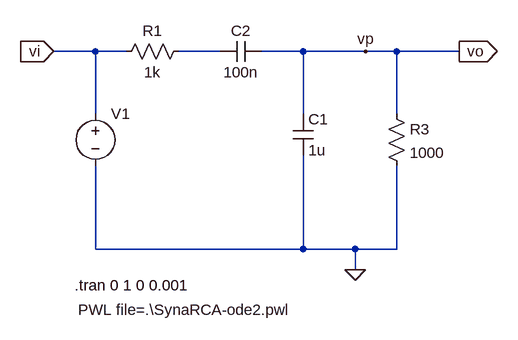
[diagram p0: schematic SynaRCA-ode2.asc]
SynaRCA-ode2.asc, the LTspice schematic file:
Version 4
SHEET 1 880 680
WIRE -256 32 -320 32
WIRE -208 32 -256 32
WIRE -64 32 -128 32
WIRE 64 32 0 32
WIRE 160 32 64 32
WIRE 208 32 160 32
WIRE 304 32 208 32
WIRE -256 128 -256 32
WIRE 64 128 64 32
WIRE 208 128 208 32
WIRE -256 336 -256 208
WIRE 64 336 64 192
WIRE 64 336 -256 336
WIRE 144 336 64 336
WIRE 208 336 208 208
WIRE 208 336 144 336
WIRE 144 368 144 336
FLAG 144 368 0
FLAG 304 32 vo
IOPIN 304 32 Out
FLAG -320 32 vi
IOPIN -320 32 In
FLAG 160 32 vp
SYMBOL cap 48 128 R0
SYMATTR InstName C1
SYMATTR Value 1u
SYMBOL res -112 16 R90
WINDOW 0 0 56 VBottom 2
WINDOW 3 32 56 VTop 2
SYMATTR InstName R1
SYMATTR Value 1k
SYMBOL res 192 112 R0
SYMATTR InstName R3
SYMATTR Value 1000
SYMBOL voltage -256 112 R0
WINDOW 3 -27 317 Left 2
WINDOW 123 0 0 Left 0
WINDOW 39 0 0 Left 0
SYMATTR Value PWL file=.\SynaRCA-ode2.pwl
SYMATTR InstName V1
SYMBOL cap 0 16 R90
WINDOW 0 0 32 VBottom 2
WINDOW 3 32 32 VTop 2
SYMATTR InstName C2
SYMATTR Value 100n
TEXT -288 392 Left 2 !.tran 0 1 0 0.001

The netlist it stands for:
* SynaRCA-ode2.asc
C1 vp 0 1u
R1 N001 vi 1k
R3 vp 0 1000
V1 vi 0 PWL file=.\SynaRCA-ode2.pwl
C2 vp N001 100n
.tran 0 1 0 0.001
.backanno
.end